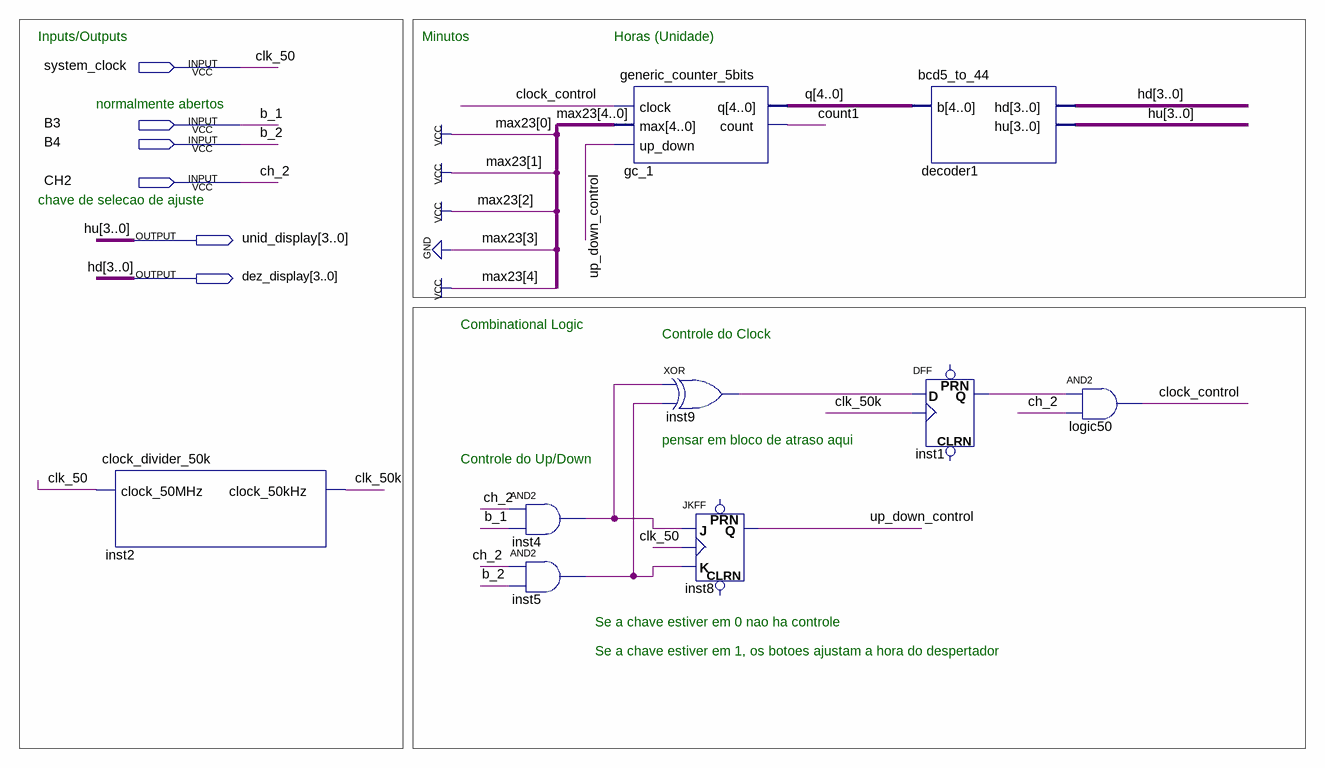
[diagram p0: schematic sheet]
// Quartus schematic hour_alarm_block.bdf as structural Verilog: 9 symbols, 6 pins
module hour_alarm_block (
  input  system_clock,
  input  B3,
  input  B4,
  input  CH2,
  output [3:0] unid_display,
  output [3:0] dez_display
);

  wire clk_50k, clock_control, count1, inst1_q, inst4_out, inst5_out, inst9_out, up_down_control;
  wire [4:0] q;

  clock_divider_50k inst2 (.clock_50MHz(system_clock), .clock_50kHz(clk_50k));
  and inst4 (inst4_out, CH2, B3);
  and inst5 (inst5_out, CH2, B4);
  generic_counter_5bits gc_1 (.clock(clock_control), .max(5'b10111), .up_down(up_down_control), .q(q), .count(count1));
  xor inst9 (inst9_out, inst4_out, inst5_out);
  JKFF inst8 (.K(inst5_out), .J(inst4_out), .CLK(system_clock), .Q(up_down_control));  // open: PRN, CLRN
  bcd5_to_44 decoder1 (.b(q), .hd(dez_display), .hu(unid_display));
  DFF inst1 (.CLK(clk_50k), .D(inst9_out), .Q(inst1_q));  // open: CLRN, PRN
  and logic50 (clock_control, inst1_q, CH2);

  // Other names for the same wires on the sheet: b_1 = B3; b_2 = B4; ch_2 = CH2; clk_50 = system_clock;
  //   hd[3:0] = dez_display; hu[3:0] = unid_display

  // Notes on the sheet:
  //   Inputs/Outputs
  //   Minutos
  //   Horas (Unidade)
  //   normalmente abertos
  //   chave de selecao de ajuste
  //   Combinational Logic
  //   Controle do Clock
  //   pensar em bloco de atraso aqui
  //   Controle do Up/Down
  //   Se a chave estiver em 0 nao ha controle
  //   Se a chave estiver em 1, os botoes ajustam a hora do despertador
endmodule
